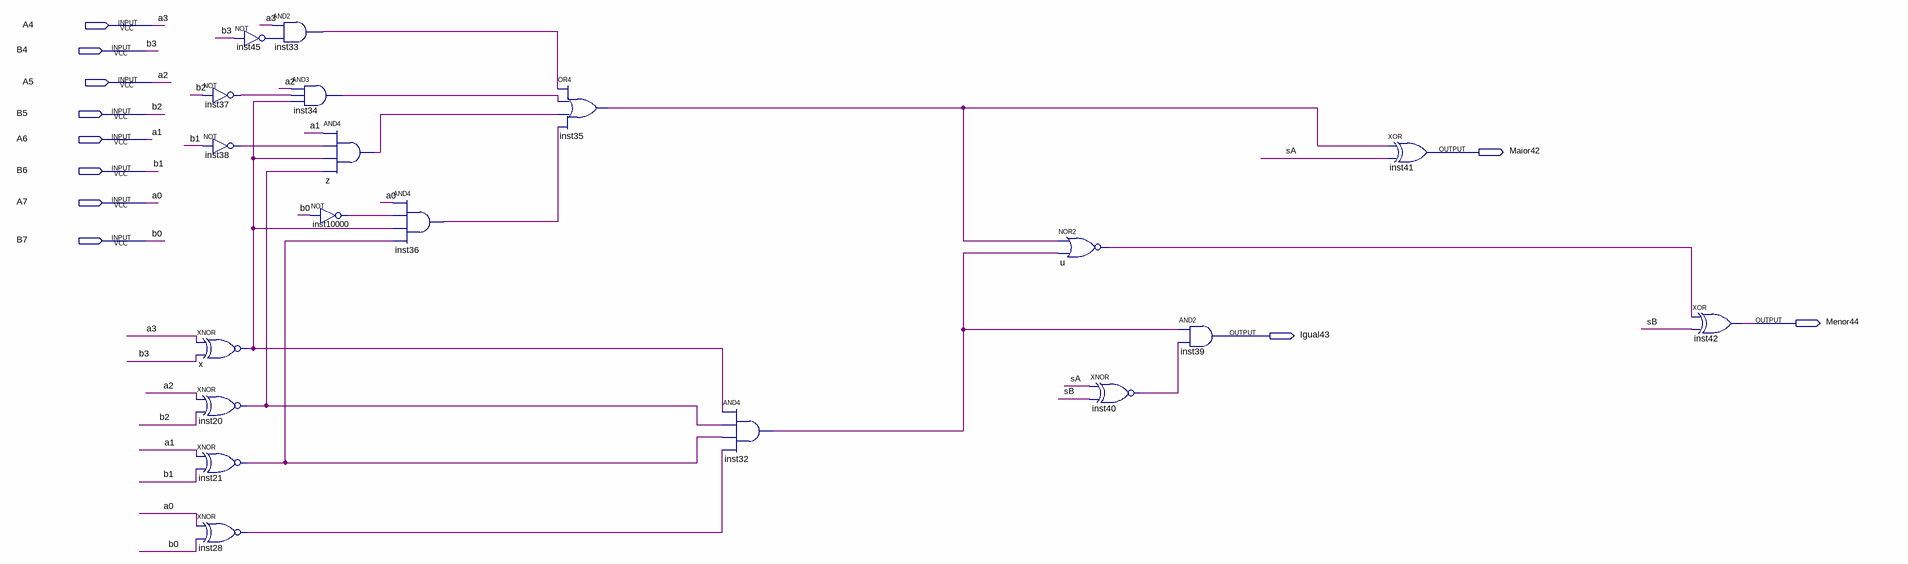
[diagram p0: schematic sheet]
// Quartus schematic rascunho.bdf as structural Verilog: 19 symbols, 11 pins
module rascunho (
  input  A4,
  input  B4,
  input  A5,
  input  B5,
  input  A6,
  input  B6,
  input  A7,
  input  B7,
  output Maior42,
  output Menor44,
  output Igual43
);

  wire inst20_out, inst21_out, inst28_out, inst32_out, inst33_out, inst34_out, inst35_out, inst36_out,
       inst37_out, inst38_out, inst40_out, inst45_out, inst10000_out, sA, sB, u_out, x_out, z_out;

  not inst45 (inst45_out, B4);
  not inst37 (inst37_out, B5);
  not inst38 (inst38_out, B6);
  xnor x (x_out, A4, B4);
  xnor inst20 (inst20_out, A5, B5);
  xnor inst21 (inst21_out, A6, B6);
  xnor inst28 (inst28_out, A7, B7);
  and inst33 (inst33_out, A4, inst45_out);
  and inst34 (inst34_out, A5, inst37_out, x_out);
  and z (z_out, A6, inst38_out, x_out, inst20_out);
  not inst10000 (inst10000_out, B7);
  and inst36 (inst36_out, A7, inst10000_out, x_out, inst21_out);
  or inst35 (inst35_out, inst33_out, inst34_out, z_out, inst36_out);
  and inst32 (inst32_out, x_out, inst20_out, inst21_out, inst28_out);
  nor u (u_out, inst35_out, inst32_out);
  xnor inst40 (inst40_out, sA, sB);
  and inst39 (Igual43, inst32_out, inst40_out);
  xor inst41 (Maior42, inst35_out, sA);
  xor inst42 (Menor44, u_out, sB);

  // Other names for the same wires on the sheet: a0 = A7; a1 = A6; a2 = A5; a3 = A4; b0 = B7; b1 = B6; b2 = B5;
  //   b3 = B4
endmodule
